# Altium project Neural_Interface.PrjPcb
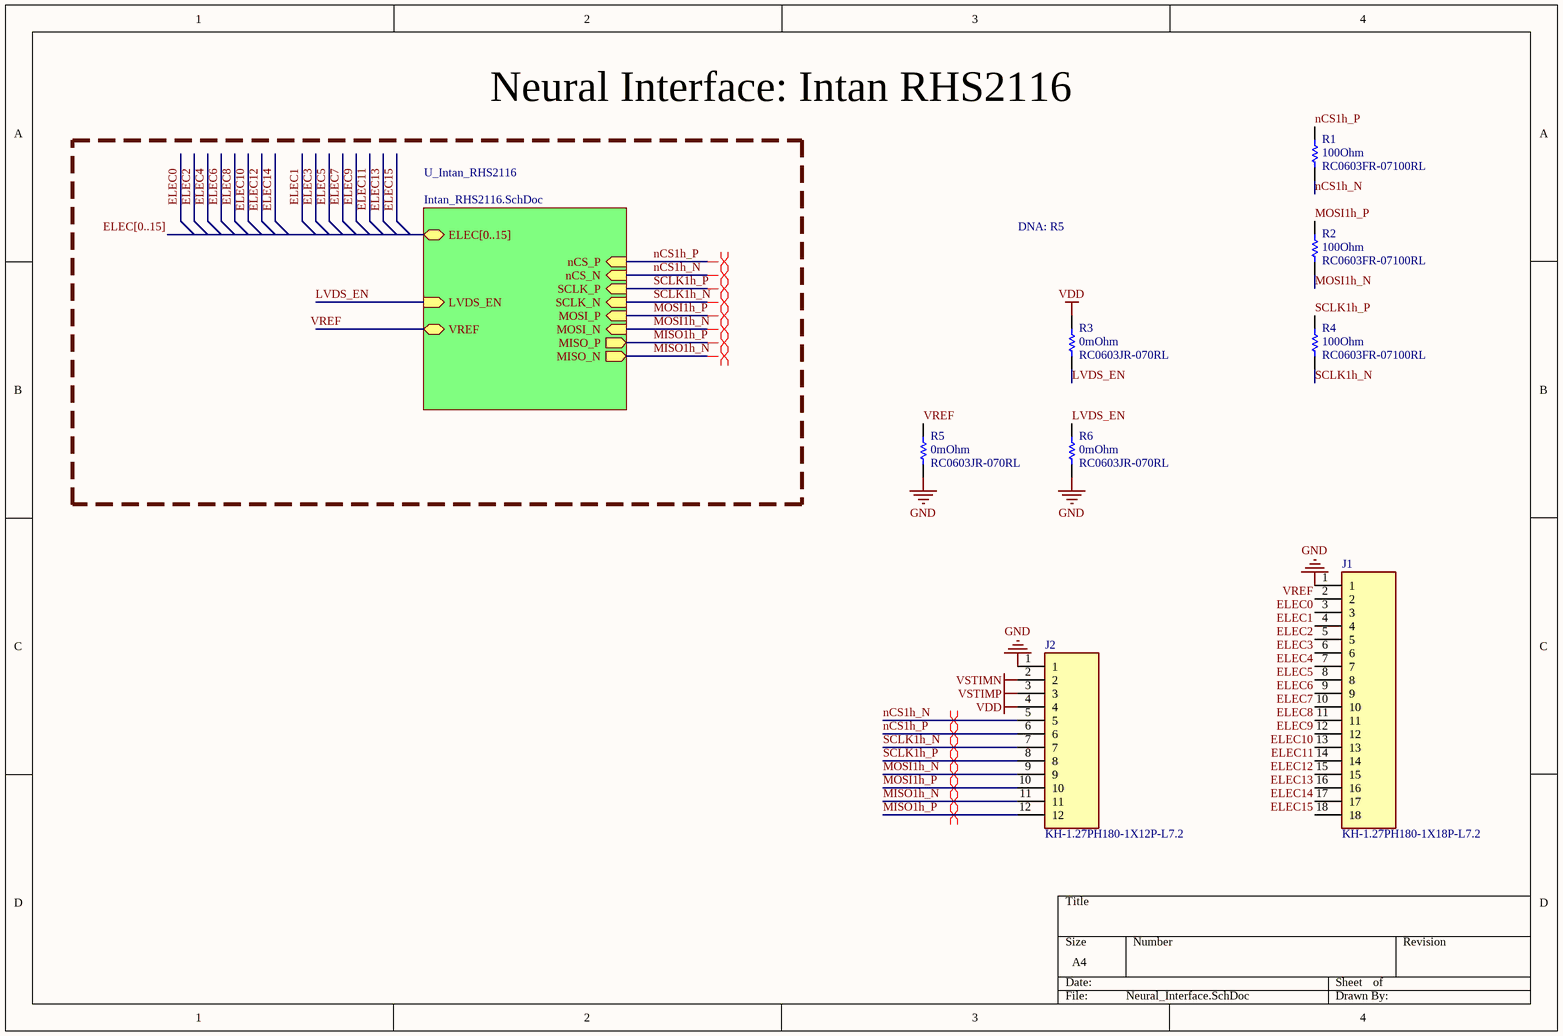
[diagram p0: Neural_Interface.SchDoc]
2 sheets, 14 parts. Net scope: hierarchical (ports join the sheet entries above them; power ports are global).
Board file: Neural_Interface.PcbDoc
Sheets:
  Neural_Interface.SchDoc
    U_Intan_RHS2116 = Intan_RHS2116.SchDoc

## Sheet Neural_Interface.SchDoc
size A4; DocumentNumber: 1; SheetNumber: 1; SheetTotal: 2

### Parts
J1  KH-1.27PH180-1X18P-L7.2  [KH-1.27PH180-1X18P-L7.2]
J2  KH-1.27PH180-1X12P-L7.2  [KH-1.27PH180-1X12P-L7.2]
R1  RC0603FR-07100RL  Resistance: 100Ohm  [RESC1608X55X25ML10T15]
R2  RC0603FR-07100RL  Resistance: 100Ohm  [RESC1608X55X25ML10T15]
R3  RC0603JR-070RL  Resistance: 0mOhm  [RESC1608X55X25ML10T15]
R4  RC0603FR-07100RL  Resistance: 100Ohm  [RESC1608X55X25ML10T15]
R5  RC0603JR-070RL  Resistance: 0mOhm  [RESC1608X55X25ML10T15]
R6  RC0603JR-070RL  Resistance: 0mOhm  [RESC1608X55X25ML10T15]

### Sub-sheets
U_Intan_RHS2116 = Intan_RHS2116.SchDoc: nCS_N (in), nCS_P (in), SCLK_N (in), SCLK_P (in), MOSI_N (in), MOSI_P (in), MISO_N (out), MISO_P (out), ELEC[0..15] (bidir), LVDS_EN (in), VREF (bidir)

### Nets
GND: J1.1 J2.1 R5.1 R6.1
VDD: J2.4 R3.2
VSTIMN: J2.2
VSTIMP: J2.3
ELEC0: J1.3
ELEC1: J1.4
ELEC2: J1.5
ELEC3: J1.6
ELEC4: J1.7
ELEC5: J1.8
ELEC6: J1.9
ELEC7: J1.10
ELEC8: J1.11
ELEC9: J1.12
ELEC10: J1.13
ELEC11: J1.14
ELEC12: J1.15
ELEC13: J1.16
ELEC14: J1.17
ELEC15: J1.18
LVDS_EN: R3.1 R6.2 ; sheet U_Intan_RHS2116/LVDS_EN
MISO1h_N: J2.11 ; sheet U_Intan_RHS2116/MISO_N
MISO1h_P: J2.12 ; sheet U_Intan_RHS2116/MISO_P
MOSI1h_N: J2.9 R2.1 ; sheet U_Intan_RHS2116/MOSI_N
MOSI1h_P: J2.10 R2.2 ; sheet U_Intan_RHS2116/MOSI_P
nCS1h_N: J2.5 R1.1 ; sheet U_Intan_RHS2116/nCS_N
nCS1h_P: J2.6 R1.2 ; sheet U_Intan_RHS2116/nCS_P
SCLK1h_N: J2.7 R4.1 ; sheet U_Intan_RHS2116/SCLK_N
SCLK1h_P: J2.8 R4.2 ; sheet U_Intan_RHS2116/SCLK_P
VREF: J1.2 R5.2 ; sheet U_Intan_RHS2116/VREF

### Buses and harness runs
bus ELEC[0..15] = sheet U_Intan_RHS2116/ELEC[0..15]

### Layout directives
differential pair: MISO1h_N, MISO1h_P, MOSI1h_N, MOSI1h_P, nCS1h_N, nCS1h_P, SCLK1h_N, SCLK1h_P

### Notes on the sheet
- Neural Interface: Intan RHS2116
- DNA: R5

### Library data of the parts
J1 = KH-1.27PH180-1X18P-L7.2: 1A Straight Square Pins 1mm 3.9mm -40℃~+105℃ 1 18 2.3mm 1.27mm 1x18P Straight, P=1.27mm Pin Headers ROHS; Manufacturer 1: Shenzhen Kinghelm Elec; Manufacturer Part Number 1: KH-1.27PH180-1X18P-L7.2
J2 = KH-1.27PH180-1X12P-L7.2: 1A Straight Square Pins 1mm 3.9mm -40℃~+105℃ 1 2.3mm 12 1.27mm 1x12P Straight, P=1.27mm Pin Headers ROHS; Manufacturer 1: Shenzhen Kinghelm Elec; Manufacturer Part Number 1: KH-1.27PH180-1X12P-L7.2
R1 R2 R4 = CMP-2100-03663-1: Chip Resistor, 100 Ohm, +/- 1%, 0.1 W, -55 to 155 degC, 0603 (1608 Metric), RoHS, Tape and Reel; Manufacturer: Yageo; Voltage Rating (DC): 50V; Power Rating: 100mW; Temperature Coefficient: 100ppm/degreesC; Number of Pins: 2; Tolerance: 1%; Height: 0.45mm; Manufacturer URL: http://www.yageo.com/; Military Standard: Not; Datasheet URL: http://www.yageo.com/NewPortal/yageodocoutput?fileName=/pdf/R-Chip/PYu-RC_Group_51_RoHS_L_5.pdf; Case Code (Imperial): 0603; Termination: SMD/SMT; Lead Free: LeadFree; Max Operating Temperature: 155degC; Case Code (Metric): 1608; RoHSCompliant: true; Voltage Rating: 50V; Width: 0.8mm; Composition: ThickFilm; Depth: 0.8mm; REACH SVHC: Unknown; Min Operating Temperature: -55degC; Packaging: TapeandReel; Package Description: 2-Pin Surface Mount Device, Body 1.6 x 0.8 mm; Length: 1.6mm; Package Reference: 0603; Datasheet Version: Rev. 5, 10/2016; Case/Package: 0603
R3 R5 R6 = CMP-2100-03667-1: Chip Resistor, 0 Ohm, +/- 5%, 0.1 W, -55 to 155 degC, 0603 (1608 Metric), RoHS, Tape and Reel; Manufacturer: Yageo; Temperature Coefficient: 200ppm/degreesC; Voltage Rating: 50V; Power Rating: 100mW; Width: 0.8mm; Max Operating Temperature: 155degC; Tolerance: 5%; Package Reference: 0603; Height: 0.45mm; Depth: 0.8mm; Package Description: 2-Pin Surface Mount Device, Body 1.6 x 0.8 mm; Termination: SMD/SMT; Package Quantity: 5000; Case/Package: 0603; Case Code (Imperial): 0603; Radiation Hardening: No; Number of Pins: 2; Length: 1.6mm; Lead Free: LeadFree; Voltage Rating (DC): 50V; Military Standard: Not; Datasheet URL: http://www.yageo.com/NewPortal/yageodocoutput?fileName=/pdf/R-Chip/PYu-RC_Group_51_RoHS_L_5.pdf; Manufacturer URL: http://www.yageo.com/; Packaging: TapeandReel; Case Code (Metric): 1608; Min Operating Temperature: -55degC; Composition: ThickFilm; RoHSCompliant: true; Contact Plating: Tin; Datasheet Version: Rev. 5, 10/2016; REACH SVHC: NoSVHC

## Sheet Intan_RHS2116.SchDoc
size A4; DocumentNumber: 2; SheetNumber: 2; SheetTotal: 2
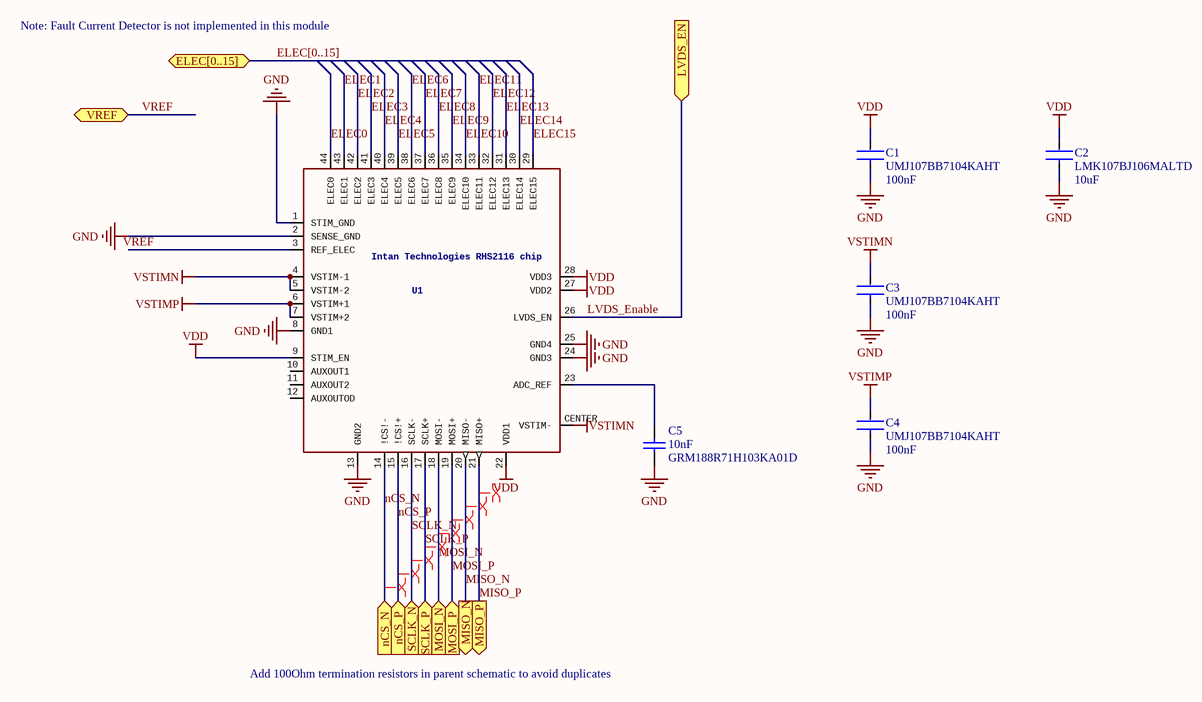
[diagram p1: Intan_RHS2116.SchDoc]

### Parts
C1  UMJ107BB7104KAHT  Capacitance: 100nF  [FP-0603-L_1_6_0_2-W_0_8_0-IPC_B]
C2  LMK107BJ106MALTD  Capacitance: 10uF  [FP-LMK107BJ106MALTD-IPC_B]
C3  UMJ107BB7104KAHT  Capacitance: 100nF  [FP-0603-L_1_6_0_2-W_0_8_0-IPC_B]
C4  UMJ107BB7104KAHT  Capacitance: 100nF  [FP-0603-L_1_6_0_2-W_0_8_0-IPC_B]
C5  GRM188R71H103KA01D  Capacitance: 10nF  [CAPC1608X90X35ML10T15]
U1  Intan Technologies RHS2116 chip  [QFN44_7_X_7]

### Ports
ELEC[0..15] (bidir), LVDS_EN (in), MISO_N (out), MISO_P (out), MOSI_N (in), MOSI_P (in), nCS_N (in), nCS_P (in), SCLK_N (in), SCLK_P (in), VREF (bidir)

### Nets
GND: C1.1 C2.1 C3.1 C4.1 C5.1 U1.1(STIM_GND) U1.2(SENSE_GND) U1.8(GND1) U1.13(GND2) U1.24(GND3) U1.25(GND4)
VDD: C1.2 C2.2 U1.9(STIM_EN) U1.22(VDD1) U1.27(VDD2) U1.28(VDD3)
VSTIMN: C3.2 U1.4(VSTIM-1) U1.5(VSTIM-2) U1.CENTER(VSTIM-)
VSTIMP: C4.2 U1.6(VSTIM+1) U1.7(VSTIM+2)
ELEC0: U1.44(ELEC0)
ELEC1: U1.43(ELEC1)
ELEC2: U1.42(ELEC2)
ELEC3: U1.41(ELEC3)
ELEC4: U1.40(ELEC4)
ELEC5: U1.39(ELEC5)
ELEC6: U1.38(ELEC6)
ELEC7: U1.37(ELEC7)
ELEC8: U1.36(ELEC8)
ELEC9: U1.35(ELEC9)
ELEC10: U1.34(ELEC10)
ELEC11: U1.33(ELEC11)
ELEC12: U1.32(ELEC12)
ELEC13: U1.31(ELEC13)
ELEC14: U1.30(ELEC14)
ELEC15: U1.29(ELEC15)
LVDS_Enable: U1.26(LVDS_EN) ; port LVDS_EN  [project net LVDS_EN]
MISO_N: U1.20(MISO-) ; port MISO_N  [project net MISO1h_N]
MISO_P: U1.21(MISO+) ; port MISO_P  [project net MISO1h_P]
MOSI_N: U1.18(MOSI-) ; port MOSI_N  [project net MOSI1h_N]
MOSI_P: U1.19(MOSI+) ; port MOSI_P  [project net MOSI1h_P]
nCS_N: U1.14(!CS!-) ; port nCS_N  [project net nCS1h_N]
nCS_P: U1.15(!CS!+) ; port nCS_P  [project net nCS1h_P]
SCLK_N: U1.16(SCLK-) ; port SCLK_N  [project net SCLK1h_N]
SCLK_P: U1.17(SCLK+) ; port SCLK_P  [project net SCLK1h_P]
VREF: U1.3(REF_ELEC) ; port VREF
NetC5_2: C5.2 U1.23(ADC_REF)

Not connected (* = marked no-connect by the designer): U1 10(AUXOUT1) 11(AUXOUT2) 12(AUXOUTOD)

### Buses and harness runs
bus ELEC[0..15] = port ELEC[0..15]

### Layout directives
differential pair: MISO1h_N, MISO1h_P, MOSI1h_N, MOSI1h_P, nCS1h_N, nCS1h_P, SCLK1h_N, SCLK1h_P

### Notes on the sheet
- Note: Fault Current Detector is not implemented in this module
- Add 100Ohm termination resistors in parent schematic to avoid duplicates

### Library data of the parts
C1 C3 C4 = CMP-14477-005276-2: Multilayer Ceramic Capacitor 0.1uF 50V X7R 10% SMD 0603 T/R; RoHS Compliant: Yes; Length: 0.063inch; Max Operating Temperature: 125°C; Case Code (Metric): 1608; Case/Package: 0603; Min Operating Temperature: -55°C; Tolerance: 10%; Mount: Surface Mount; Ratings: AEC-Q200; Features: Soft Termination; Thickness: 0.039inch; Width: 0.031inch; Packaging: Tape and Reel; Case Code (Imperial): 0603; Voltage Rating: 50V
C2 = CMP-2000-05443-2: CAP CER 10UF 10V X5R 0603; Tolerance: 20%; Series: M; Case Code (Metric): 1608; Height: 0.8mm; Resistor Type: Ceramic; Length: 1.6mm; REACH SVHC: No SVHC; Package Quantity: 4000; Lead Free: Lead Free; Voltage Rating (DC): 10V; Thickness: 0.035inch; Width: 0.031inch; Max Operating Temperature: 85°C; Number of Pins: 2; RoHS Compliant: Yes; Voltage Rating: 10V; Case/Package: 0603; Termination: SMD/SMT; Min Operating Temperature: -55°C; Dielectric: X5R; Construction: Flat; Packaging: Tape and Reel; Mount: Surface Mount; Case Code (Imperial): 0603
C5 = CMP-2100-03642-1: Chip Capacitor, 10 nF, +/- 10%, 50 V, -55 to 125 degC, 0603 (1608 Metric), RoHS, Tape and Reel; Manufacturer: Murata; Insulation Resistance: 10GR; Dielectric: X7R; Voltage Rating: 50V; Material: Ceramic; Package Quantity: 1; Lead Free: LeadFree; Case/Package: 0603; Termination: SMD/SMT; REACH SVHC: Unknown; Manufacturer URL: http://www.murata.com/; Datasheet URL: http://search.murata.co.jp/Ceramy/image/img/A01X/G101/ENG/GRM188R71H103KA01-01.pdf; Mount: SurfaceMount; Datasheet Version: 42401.0; Number of Pins: 2; Length: 1.6mm; Voltage: 50V; Depth: 0.8mm; Tolerance: 10%; Min Operating Temperature: -55degC; Voltage Rating (DC): 50V; Max Operating Temperature: 125degC; Package Description: 2-Pin Surface Mount Device, Body 1.6 x 0.8 mm; RoHSCompliant: True; Case Code (Imperial): 0603; Width: 0.031inch; Case Code (Metric): 1608; Height: 0.8mm; Package Reference: 0603; Packaging: TapeandReel; Thickness: 0.035inch; Dielectric Material: Ceramic
U1 = RHS2116_QFN: ComponentLink1Discription: Datasheet; ComponentLink2Discription: Bare Die; Pricing 1: 1-24=325;  25-99=278;  100-249=233;  250-499=188;  500-999=151  (USD); Supplier 1: Intan; Manufacturer: Intan Technologies; Manufacturer Part Number: RHS2116; Supplier Part Number 1: RHS2116; ComponentLink1URL: http://intantech.com/files/Intan_RHS2116_datasheet.pdf; ComponentLink2URL: http://intantech.com/files/RHS2116_die_diagram.pdf; Supplier Link 1: http://intantech.com/products_RHS2000.html

## Nets that join several sheets
GND: Neural_Interface (J1.1 J2.1 R5.1 R6.1), Intan_RHS2116 (11 pins)
VDD: Neural_Interface (J2.4 R3.2), Intan_RHS2116 (6 pins)
VSTIMN: Neural_Interface (J2.2), Intan_RHS2116 (C3.2 U1.4 U1.5 U1.CENTER)
VSTIMP: Neural_Interface (J2.3), Intan_RHS2116 (C4.2 U1.6 U1.7)
ELEC0: Neural_Interface (J1.3), Intan_RHS2116 (U1.44)
ELEC1: Neural_Interface (J1.4), Intan_RHS2116 (U1.43)
ELEC2: Neural_Interface (J1.5), Intan_RHS2116 (U1.42)
ELEC3: Neural_Interface (J1.6), Intan_RHS2116 (U1.41)
ELEC4: Neural_Interface (J1.7), Intan_RHS2116 (U1.40)
ELEC5: Neural_Interface (J1.8), Intan_RHS2116 (U1.39)
ELEC6: Neural_Interface (J1.9), Intan_RHS2116 (U1.38)
ELEC7: Neural_Interface (J1.10), Intan_RHS2116 (U1.37)
ELEC8: Neural_Interface (J1.11), Intan_RHS2116 (U1.36)
ELEC9: Neural_Interface (J1.12), Intan_RHS2116 (U1.35)
ELEC10: Neural_Interface (J1.13), Intan_RHS2116 (U1.34)
ELEC11: Neural_Interface (J1.14), Intan_RHS2116 (U1.33)
ELEC12: Neural_Interface (J1.15), Intan_RHS2116 (U1.32)
ELEC13: Neural_Interface (J1.16), Intan_RHS2116 (U1.31)
ELEC14: Neural_Interface (J1.17), Intan_RHS2116 (U1.30)
ELEC15: Neural_Interface (J1.18), Intan_RHS2116 (U1.29)
LVDS_EN: Neural_Interface (R3.1 R6.2), Intan_RHS2116 (U1.26)
MISO1h_N: Neural_Interface (J2.11), Intan_RHS2116 (U1.20)
MISO1h_P: Neural_Interface (J2.12), Intan_RHS2116 (U1.21)
MOSI1h_N: Neural_Interface (J2.9 R2.1), Intan_RHS2116 (U1.18)
MOSI1h_P: Neural_Interface (J2.10 R2.2), Intan_RHS2116 (U1.19)
nCS1h_N: Neural_Interface (J2.5 R1.1), Intan_RHS2116 (U1.14)
nCS1h_P: Neural_Interface (J2.6 R1.2), Intan_RHS2116 (U1.15)
SCLK1h_N: Neural_Interface (J2.7 R4.1), Intan_RHS2116 (U1.16)
SCLK1h_P: Neural_Interface (J2.8 R4.2), Intan_RHS2116 (U1.17)
VREF: Neural_Interface (J1.2 R5.2), Intan_RHS2116 (U1.3)